# Altium schematic sheet layout.SchDoc
size A4
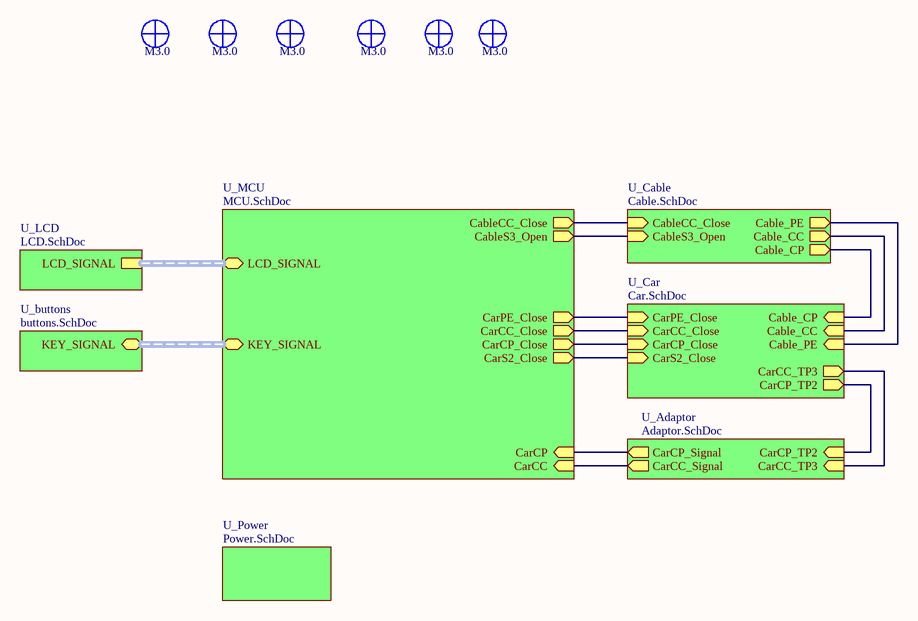
[diagram p0: layout.SchDoc]

## Parts
H1  M3.0  [SCREW_HOLE_3.5]  (value not drawn)  (no BOM)
H2  M3.0  [SCREW_HOLE_3.5]  (value not drawn)  (no BOM)
H3  M3.0  [SCREW_HOLE_3.5]  (value not drawn)  (no BOM)
H4  M3.0  [SCREW_HOLE_3.5]  (value not drawn)  (no BOM)
H5  M3.0  [SCREW_HOLE_3.5]  (value not drawn)  (no BOM)
H6  M3.0  [SCREW_HOLE_3.5]  (value not drawn)  (no BOM)

## Sub-sheets
U_Adaptor = Adaptor.SchDoc: CarCP_Signal (out), CarCP_TP2 (in), CarCC_TP3 (in), CarCC_Signal (out)
U_buttons = buttons.SchDoc: KEY_SIGNAL (harness Key)
U_Cable = Cable.SchDoc: CableCC_Close (in), Cable_CC (out), CableS3_Open (in), Cable_PE (out), Cable_CP (out)
U_Car = Car.SchDoc: Cable_CC (in), Cable_CP (in), CarPE_Close (in), CarCC_Close (in), CarCP_Close (in), CarCC_TP3 (out), CarS2_Close (in), CarCP_TP2 (out), Cable_PE (in)
U_LCD = LCD.SchDoc: LCD_SIGNAL (harness LCD)
U_MCU = MCU.SchDoc: CableCC_Close (out), CableS3_Open (out), CarPE_Close (out), CarCC_Close (out), CarCP_Close (out), CarS2_Close (out), CarCC (in), CarCP (in), LCD_SIGNAL (harness LCD), KEY_SIGNAL (harness Key)
U_Power = Power.SchDoc: no entries

## Nets
(unnamed): sheet U_MCU/CableCC_Close, sheet U_Cable/CableCC_Close
(unnamed): sheet U_MCU/CableS3_Open, sheet U_Cable/CableS3_Open
(unnamed): sheet U_MCU/CarPE_Close, sheet U_Car/CarPE_Close
(unnamed): sheet U_MCU/CarCC_Close, sheet U_Car/CarCC_Close
(unnamed): sheet U_MCU/CarCP_Close, sheet U_Car/CarCP_Close
(unnamed): sheet U_MCU/CarS2_Close, sheet U_Car/CarS2_Close
(unnamed): sheet U_MCU/CarCC, sheet U_Adaptor/CarCC_Signal
(unnamed): sheet U_MCU/CarCP, sheet U_Adaptor/CarCP_Signal
(unnamed): sheet U_Cable/Cable_CC, sheet U_Car/Cable_CC
(unnamed): sheet U_Cable/Cable_PE, sheet U_Car/Cable_PE
(unnamed): sheet U_Cable/Cable_CP, sheet U_Car/Cable_CP
(unnamed): sheet U_Car/CarCC_TP3, sheet U_Adaptor/CarCC_TP3
(unnamed): sheet U_Car/CarCP_TP2, sheet U_Adaptor/CarCP_TP2

## Buses and harness runs
harness sheet U_buttons/KEY_SIGNAL = sheet U_MCU/KEY_SIGNAL
harness sheet U_LCD/LCD_SIGNAL = sheet U_MCU/LCD_SIGNAL

## Library data of the parts
H1-H6 = SCRE_HOLE_3.5: Screw hole for M3.0